# EasyEDA Pro project ProPrj_Xen_2025-02-04.epro, board PCB1_4
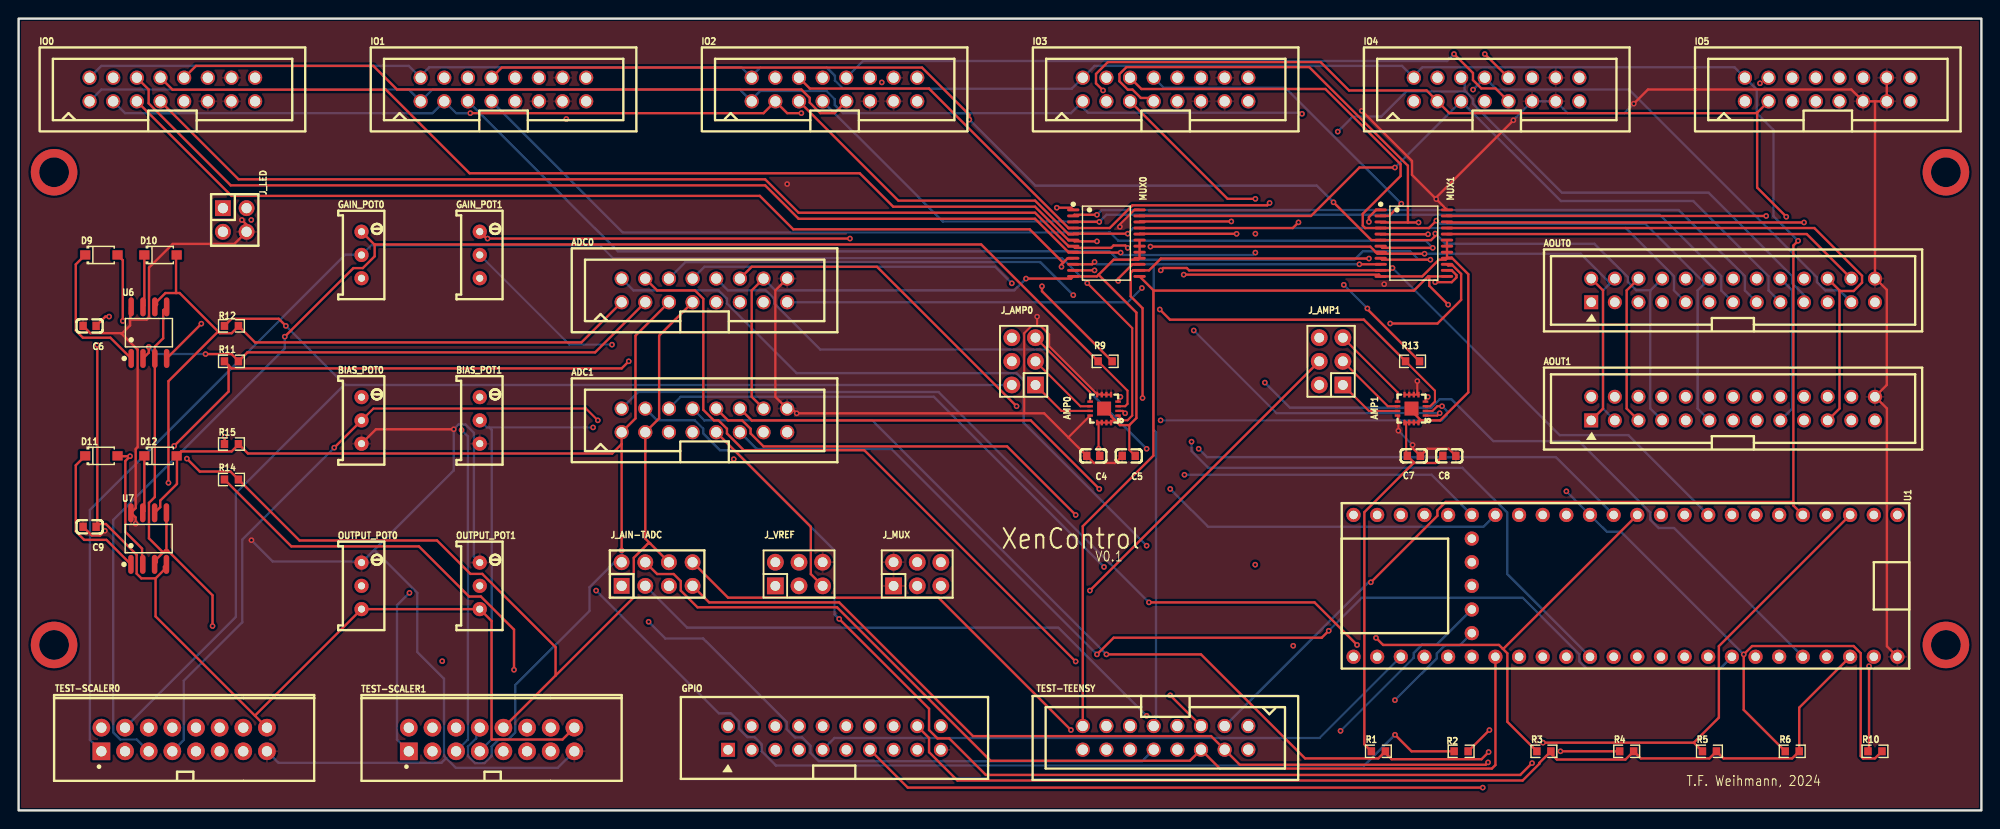
[diagram p32: board, top side]
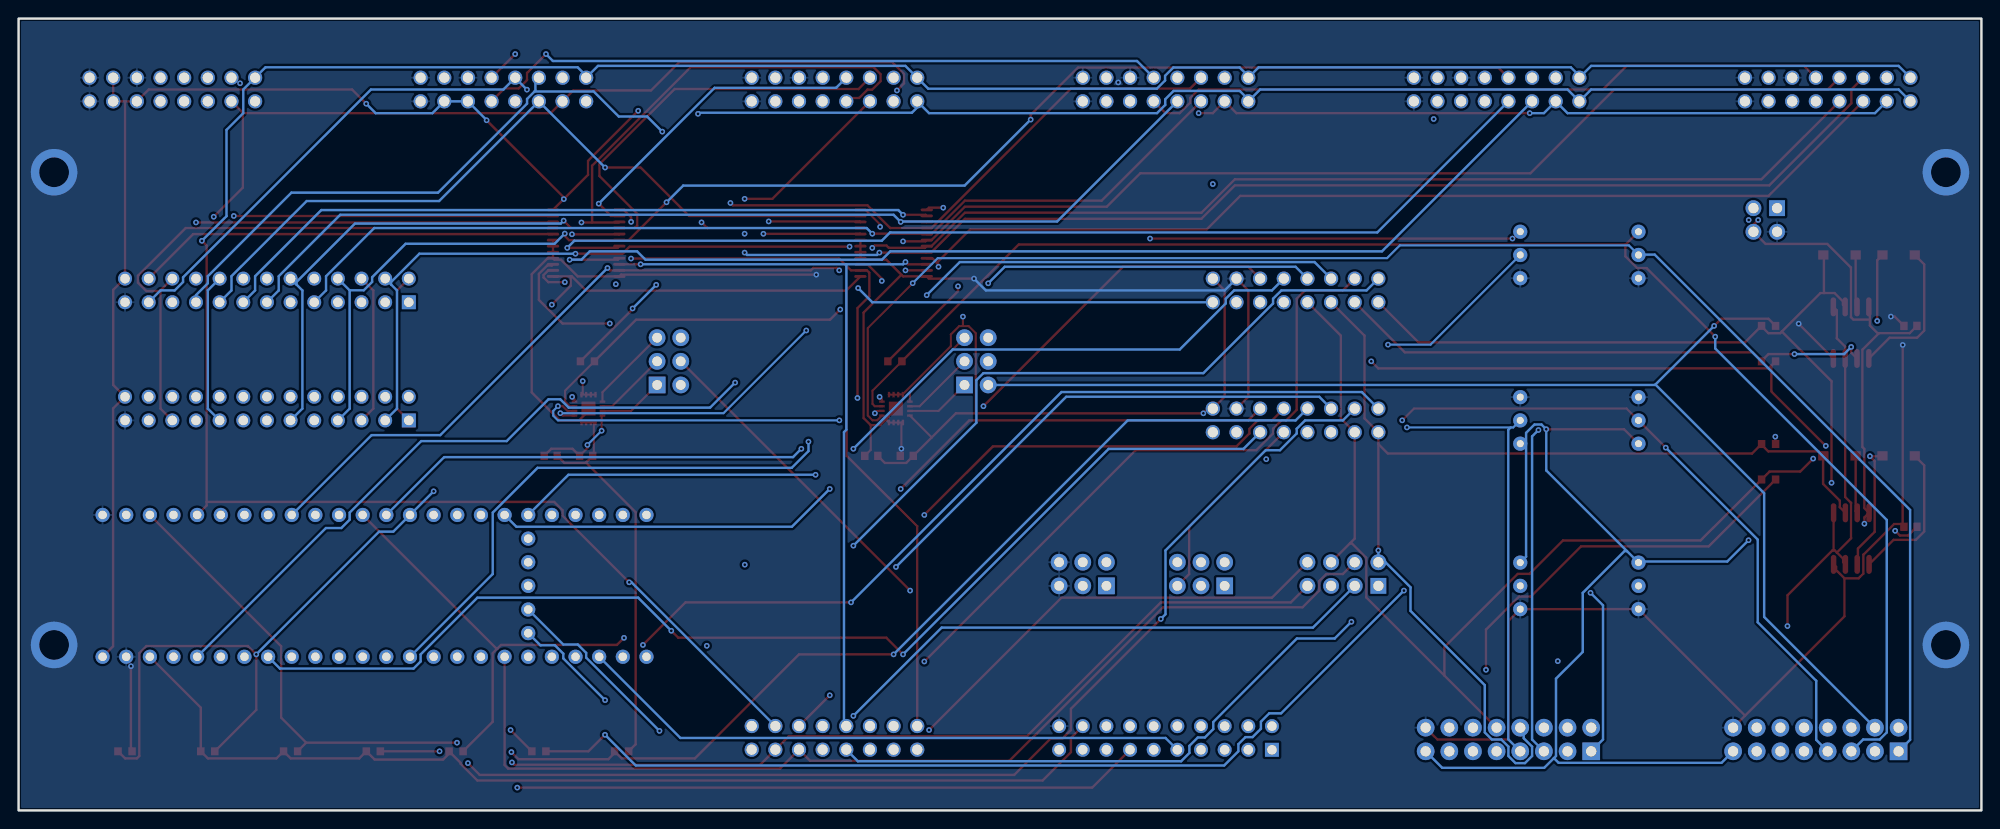
[diagram p33: board, bottom side, seen from below]

Outline 210.82 x 85.09 mm; copper layers: Top Layer, Inner1, Inner2, Bottom Layer. Coordinates in mm from the lower left corner of the outline.
Outline path: rectangle 0,85.09 210.82,0
Stack: Top Layer 0.035mm Outer layer copper thickness 1oz / Dielectric1 0.2104mm 7628 RC49% 8.6mil / Inner1 0.0152mm Inner layer copper thickness / Dielectric2 1.065mm 1.1mm H/HOZ Copper / Inner2 0.0152mm Inner layer copper thickness / Dielectric3 0.2104mm 7628 RC49% 8.6mil / Bottom Layer 0.035mm Outer layer copper thickness 1oz

## Design rules (mm)
template: Custom Config
spacing copperThickness1oz (default): track to track 0.102, other pairs 0.152 to 0.3
spacing copperThickness2oz: track to track 0.203, other pairs 0.152 to 0.3
track width Default (default): min 0.127, default 0.254, max 2.54
track width Analog: min 0.127, default 0.254, max 2.54
track width Power: min 0.127, default 0.254, max 2.54
differential pair differentialPair (default): width min 0.127, default 0.254, max 2.54; gap min 0.152, default 0.152
via viaSize (default): diameter min 0.5, default 0.61, max 10; hole min 0.3, default 0.305, max 6.299
net LIMITER_OUT0- uses Analog
net LIMITER_OUT0+ uses Analog
net LIMITER_OUT1- uses Analog
net LIMITER_OUT1+ uses Analog
net MUX_OUT0 uses Analog
net GND uses Power
net MUX_OUT1 uses Analog
net +5V uses Power
net AM23 uses Analog
net AM11 uses Analog
net AM22 uses Analog
net AM10 uses Analog
net AM21 uses Analog
net AM9 uses Analog
net AM20 uses Analog
net AM8 uses Analog
net AM19 uses Analog
net AM7 uses Analog
net AM18 uses Analog
net AM6 uses Analog
net AM17 uses Analog
net AM5 uses Analog
net AM16 uses Analog
net AM4 uses Analog
net AM15 uses Analog
net AM3 uses Analog
net AM14 uses Analog
net AM2 uses Analog
net AM13 uses Analog
net AM1 uses Analog
net AM12 uses Analog
net AM0 uses Analog
net OFFSET_OUT0+ uses Analog
net OFFSET_OUT0- uses Analog
net OFFSET_OUT1+ uses Analog
net OFFSET_OUT1- uses Analog

## Placement (name value [footprint] x y rotation side)
ADC0  2.54-2*8P简牛  [IDC-TH_16P-P2.54_C3406]  73.66 55.88 0 top
ADC1  2.54-2*8P简牛  [IDC-TH_16P-P2.54_C3406]  73.66 41.91 0 top
AMP0  THS4541IRGTT  [TQFN-16_L3.0-W3.0-P0.50-BL-EP1.5]  116.59 43.18 90 top
AMP1  THS4541IRGTT  [TQFN-16_L3.0-W3.0-P0.50-BL-EP1.5]  149.61 43.18 90 top
AOUT0  ZX-IDC2.54-2-13PZZ  [IDC-TH_26P-P2.54_ZX-IDC2.54-2-13PZZ]  184.15 55.88 0 top
AOUT1  ZX-IDC2.54-2-13PZZ  [IDC-TH_26P-P2.54_ZX-IDC2.54-2-13PZZ]  184.15 43.18 0 top
BIAS_POT0  50kΩ  [RES-ADJ-TH_3P-L9.5-W4.85-P2.50-BL-BS]  36.83 41.91 0 top
BIAS_POT1  50kΩ  [RES-ADJ-TH_3P-L9.5-W4.85-P2.50-BL-BS]  49.53 41.91 0 top
C4  0.1uF  [C0603]  115.42 38.1 180 top
C5  1000pF  [C0603]  119.23 38.1 180 top
C6  0.1uF  [C0603]  7.62 52.07 180 top
C7  0.1uF  [C0603]  149.86 38.1 0 top
C8  1000pF  [C0603]  153.67 38.1 0 top
C9  0.1uF  [C0603]  7.62 30.48 180 top
D9  1N4148W  [SOD-123F_L2.7-W1.6-LS3.8-RD]  8.89 59.69 0 top
D10  1N4148W  [SOD-123F_L2.7-W1.6-LS3.8-RD]  15.24 59.69 0 top
D11  1N4148W  [SOD-123F_L2.7-W1.6-LS3.8-RD]  8.89 38.1 0 top
D12  1N4148W  [SOD-123F_L2.7-W1.6-LS3.8-RD]  15.24 38.1 0 top
GAIN_POT0  200kΩ  [RES-ADJ-TH_3P-L9.5-W4.85-P2.50-BL-BS]  36.83 59.69 0 top
GAIN_POT1  200kΩ  [RES-ADJ-TH_3P-L9.5-W4.85-P2.50-BL-BS]  49.53 59.69 0 top
GPIO  ZX-IDC2.54-2-10PZZ  [IDC-TH_20P-P2.54_ZX-IDC2.54-2-10PZZ]  87.63 7.78 0 top
IO0  2.54-2*8P简牛  [IDC-TH_16P-P2.54_C3406]  16.51 77.47 0 top
IO1  2.54-2*8P简牛  [IDC-TH_16P-P2.54_C3406]  52.07 77.47 0 top
IO2  2.54-2*8P简牛  [IDC-TH_16P-P2.54_C3406]  87.63 77.47 0 top
IO3  2.54-2*8P简牛  [IDC-TH_16P-P2.54_C3406]  123.19 77.47 0 top
IO4  2.54-2*8P简牛  [IDC-TH_16P-P2.54_C3406]  158.75 77.47 0 top
IO5  2.54-2*8P简牛  [IDC-TH_16P-P2.54_C3406]  194.31 77.47 0 top
J_AIN-TADC  PZ2.54-2*4  [HDR-TH_8P-P2.54-V-M-R2-C4-S2.54]  68.58 25.4 0 top
J_AMP0  ZX-PZ2.54-2-3PZZ  [HDR-TH_6P-P2.54-V-M-R2-C3-S2.54-1]  107.95 48.26 90 top
J_AMP1  ZX-PZ2.54-2-3PZZ  [HDR-TH_6P-P2.54-V-M-R2-C3-S2.54-1]  140.97 48.26 90 top
J_LED  PZ254V-12-4P  [HDR-TH_4P-P2.54-V-M-R2-C2-S2.54]  23.21 63.45 270 top
J_MUX  ZX-PZ2.54-2-3PZZ  [HDR-TH_6P-P2.54-V-M-R2-C3-S2.54-1]  96.52 25.4 0 top
J_VREF  ZX-PZ2.54-2-3PZZ  [HDR-TH_6P-P2.54-V-M-R2-C3-S2.54-1]  83.82 25.4 0 top
MUX0  CD74HC4067SM96  [SSOP-24_L8.1-W5.3-P0.65-LS7.8-BL]  116.84 60.96 270 top
MUX1  CD74HC4067SM96  [SSOP-24_L8.1-W5.3-P0.65-LS7.8-BL]  149.86 60.96 270 top
OUTPUT_POT0  50kΩ  [RES-ADJ-TH_3P-L9.5-W4.85-P2.50-BL-BS]  36.83 24.13 0 top
OUTPUT_POT1  50kΩ  [RES-ADJ-TH_3P-L9.5-W4.85-P2.50-BL-BS]  49.53 24.13 0 top
R1  10K  [R0603]  146.05 6.35 0 top
R2  330  [R0603]  154.94 6.35 0 top
R3  10K  [R0603]  163.83 6.35 0 top
R4  10K  [R0603]  172.72 6.35 0 top
R5  10K  [R0603]  181.61 6.35 0 top
R6  10K  [R0603]  190.5 6.35 0 top
R9  12K  [R0603]  116.7 48.26 0 top
R10  10K  [R0603]  199.39 6.35 0 top
R11  1k  [R0603]  22.86 48.26 0 top
R12  1k  [R0603]  22.86 52.07 0 top
R13  12K  [R0603]  149.72 48.26 0 top
R14  1k  [R0603]  22.86 35.56 0 top
R15  1k  [R0603]  22.86 39.37 0 top
TEST-SCALER0  IDC16  [CONN-TH_16P-P2.54_TE_1761681-6]  17.78 7.62 0 top
TEST-SCALER1  IDC16  [CONN-TH_16P-P2.54_TE_1761681-6]  50.8 7.62 0 top
TEST-TEENSY  2.54-2*8P简牛  [IDC-TH_16P-P2.54_C3406]  123.19 7.8 180 top
U1  -  [TEENSY 4.1]  171.45 24.13 270 top
U6  TL072G  [SOIC-8_L4.9-W3.9-P1.27-LS6.0-BL]  13.99 51.34 0 top
U7  TL072G  [SOIC-8_L4.9-W3.9-P1.27-LS6.0-BL]  13.97 29.21 0 top

## Footprints (pads in the part's own frame, mm; a bottom-side part is the same pattern mirrored in y, then rotated)
C0603
  rect 0.8x0.9 smd: 1(-0.7,0) 2(0.7,0)
CONN-TH_16P-P2.54_TE_1761681-6
  rect 1.9x1.9 hole 1.1: 1(-8.89,-1.27)
  round 1.9 hole 1.1: 2(-8.89,1.27) 3(-6.35,-1.27) 4(-6.35,1.269) 5(-3.81,-1.27) 6(-3.81,1.269) 7(-1.27,-1.27) 8(-1.27,1.269) 9(1.27,-1.27) 10(1.27,1.269) 11(3.81,-1.27) 12(3.81,1.269) 13(6.35,-1.27) 14(6.35,1.269) 15(8.89,-1.27) 16(8.89,1.269)
HDR-TH_4P-P2.54-V-M-R2-C2-S2.54
  rect 1.7x1.7 hole 1.1: 1(-1.27,-1.27)
  round 1.7 hole 1.1: 2(-1.27,1.27) 3(1.27,-1.27) 4(1.27,1.27)
HDR-TH_6P-P2.54-V-M-R2-C3-S2.54-1
  rect 1.8x1.8 hole 1.05: 1(-2.54,-1.27)
  round 1.8 hole 1.05: 2(-2.54,1.27) 3(0,-1.27) 4(0,1.27) 5(2.54,-1.27) 6(2.54,1.27)
HDR-TH_8P-P2.54-V-M-R2-C4-S2.54
  rect 1.7x1.7 hole 1.1: 1(-3.81,-1.27)
  round 1.7 hole 1.1: 2(-3.81,1.27) 3(-1.27,-1.27) 4(-1.27,1.27) 5(1.27,-1.27) 6(1.27,1.27) 7(3.81,-1.27) 8(3.81,1.27)
IDC-TH_16P-P2.54_C3406
  round 1.524 hole 1.1: 1(-8.89,-1.27) 2(-8.89,1.27) 3(-6.35,-1.27) 4(-6.35,1.27) 5(-3.81,-1.27) 6(-3.81,1.27) 7(-1.27,-1.27) 8(-1.27,1.27) 9(1.27,-1.27) 10(1.27,1.27) 11(3.81,-1.27) 12(3.81,1.27) 13(6.35,-1.27) 14(6.35,1.27) 15(8.89,-1.27) 16(8.89,1.27)
IDC-TH_20P-P2.54_ZX-IDC2.54-2-10PZZ
  rect 1.5x1.5 hole 1.02: 1(-11.43,-1.27)
  round 1.5 hole 1.02: 2(-11.43,1.27) 3(-8.89,-1.27) 4(-8.89,1.27) 5(-6.35,-1.27) 6(-6.35,1.27) 7(-3.81,-1.27) 8(-3.81,1.27) 9(-1.27,-1.27) 10(-1.27,1.27) 11(1.27,-1.27) 12(1.27,1.27) 13(3.81,-1.27) 14(3.81,1.27) 15(6.35,-1.27) 16(6.35,1.27) 17(8.89,-1.27) 18(8.89,1.27) 19(11.43,-1.27) 20(11.43,1.27)
IDC-TH_26P-P2.54_ZX-IDC2.54-2-13PZZ
  rect 1.5x1.5 hole 1.02: 1(-15.24,-1.27)
  round 1.5 hole 1.02: 2(-15.24,1.27) 3(-12.7,-1.27) 4(-12.7,1.27) 5(-10.16,-1.27) 6(-10.16,1.27) 7(-7.62,-1.27) 8(-7.62,1.27) 9(-5.08,-1.27) 10(-5.08,1.27) 11(-2.54,-1.27) 12(-2.54,1.27) 13(0,-1.27) 14(0,1.27) 15(2.54,-1.27) 16(2.54,1.27) 17(5.08,-1.27) 18(5.08,1.27) 19(7.62,-1.27) 20(7.62,1.27) 21(10.16,-1.27) 22(10.16,1.27) 23(12.7,-1.27) 24(12.7,1.27) 25(15.24,-1.27) 26(15.24,1.27)
R0603
  rect 0.806x0.864 smd: 1(-0.753,0) 2(0.753,0)
RES-ADJ-TH_3P-L9.5-W4.85-P2.50-BL-BS
  round 1.524 hole 0.762: 1(0,2.5) 2(0,0) 3(0,-2.5)
SOD-123F_L2.7-W1.6-LS3.8-RD
  rect 1.1x1 smd: 1(-1.735,0) 2(1.735,0)
SOIC-8_L4.9-W3.9-P1.27-LS6.0-BL
  oval 0.588x2.045 smd: 1(-1.905,-2.772) 2(-0.635,-2.772) 3(0.635,-2.772) 4(1.905,-2.772) 5(1.905,2.772) 6(0.635,2.772) 7(-0.635,2.772) 8(-1.905,2.772)
SSOP-24_L8.1-W5.3-P0.65-LS7.8-BL
  oval 0.308x1.324 smd: 1(-3.575,-3.562) 2(-2.925,-3.562) 3(-2.275,-3.562) 4(-1.625,-3.562) 5(-0.975,-3.562) 6(-0.325,-3.562) 7(0.325,-3.562) 8(0.975,-3.562) 9(1.625,-3.562) 10(2.275,-3.562) 11(2.925,-3.562) 12(3.575,-3.562) 13(3.575,3.562) 14(2.925,3.562) 15(2.275,3.562) 16(1.625,3.562) 17(0.975,3.562) 18(0.325,3.562) 19(-0.325,3.562) 20(-0.975,3.562) 21(-1.625,3.562) 22(-2.275,3.562) 23(-2.925,3.562) 24(-3.575,3.562)
TEENSY 4.1
  round 1.524 hole 0.914: 1(-7.62,30.353) 2(-7.62,27.813) 3(-7.62,25.273) 4(-7.62,22.733) 5(-7.62,20.193) 6(-7.62,17.653) 7(-7.62,15.113) 8(-7.62,12.573) 9(-7.62,10.033) 10(-7.62,7.493) 11(-7.62,4.953) 12(-7.62,2.413) 13(-7.62,-0.127) 14(-7.62,-2.667) 15(-7.62,-5.207) 16(-7.62,-7.747) 17(-7.62,-10.287) 18(-7.62,-12.827) 19(-7.62,-15.367) 20(-7.62,-17.907) 21(-7.62,-20.447) 22(-7.62,-22.987) 23(-7.62,-25.527) 24(-7.62,-28.067) 25(7.62,30.353) 26(7.62,27.813) 27(7.62,25.273) 28(7.62,22.733) 29(7.62,20.193) 30(7.62,17.653) 31(7.62,15.113) 32(7.62,12.573) 33(7.62,10.033) 34(7.62,7.493) 35(7.62,4.953) 36(7.62,2.413) 37(7.62,-0.127) 38(7.62,-2.667) 39(7.62,-5.207) 40(7.62,-7.747) 41(7.62,-10.287) 42(7.62,-12.827) 43(7.62,-15.367) 44(7.62,-17.907) 45(7.62,-20.447) 46(7.62,-22.987) 47(7.62,-25.527) 48(7.62,-28.067) 49(5.08,-15.367) 50(2.54,-15.367) 51(0,-15.367) 52(-2.54,-15.367) 53(-5.08,-15.367)
TQFN-16_L3.0-W3.0-P0.50-BL-EP1.5
  rect 0.25x0.6 smd: 1(-0.749,-1.5) 2(-0.248,-1.5) 3(0.252,-1.5) 4(0.751,-1.5) 9(0.75,1.5) 10(0.25,1.5) 11(-0.25,1.5) 12(-0.749,1.5)
  rect 0.6x0.25 smd: 5(1.5,-0.748) 6(1.5,-0.248) 7(1.5,0.252) 8(1.5,0.752) 13(-1.5,0.752) 14(-1.5,0.252) 15(-1.5,-0.248) 16(-1.5,-0.748)
  rect 1.5x1.5 smd: 17(0,0)

## Nets
As in the schematic.

Pads without a net: IO5 10; TEST-SCALER0 9 11 13; TEST-SCALER1 9 11 13; TEST-TEENSY 12 14 16; U1 15 39 51 52 53

## Via types
v1: diameter 0.61, hole 0.305, Top Layer to Bottom Layer, 158 vias
v2: diameter 5, hole 3.2, Top Layer to Bottom Layer, 4 vias

## Routing (per net, layer and track width the routed paths; a pad name or vN(x,y) marks a point on that pad's centre or on a via; arc(x,y) is an arc through that point)
+3.3V: length 210.7
  Top Layer w0.254: U1.27 191.25,11.04 R6.2 190.49,5.59 183.13,5.59 R5.2 181.6,5.59 174.24,5.59 R4.2 172.59,5.47 165.22,5.47 164.46,6.23 ; GPIO.18 97.79,7.78 97.79,6.26 100.84,3.21 161.54,3.21 163.34,5.01 163.34,5.11 164.46,6.23 ; 164.46,6.23 R3.2
  Inner1 w0.254: 81.29,26.68 82.56,25.41 82.56,23.13 81.66,22.23 70.49,22.23 TEST-SCALER1.14 55.88,10.16 25.4,10.16 TEST-SCALER0.14 ; 81.29,26.68 82.46,27.85 84.33,27.85 85.09,27.09 85.09,20.48 GPIO.18 ; 81.29,26.68 J_VREF.2
+5V: length 672
  Top Layer w0.225: AMP1.12 148.2,42.34 v1(148.2,40.8) ; 109.39,52.05 108.78,52.05 108.01,51.28 108.01,42.67 ; 109.39,52.05 109.79,52.05 110.69,51.15 110.69,49.88 115.84,44.73 115.84,44.71 ; 109.39,52.05 v1(109.39,53.06) ; AMP0.5 AMP0.6 AMP0.7 116.31,44.71 115.84,44.71 ; C7.2 149.72,38.94 v1(149.72,39.28) ; MUX0.24 119.85,64.54 118.28,62.97 v1(118.28,62.71) ; 115.84,44.71 AMP0.8 ; 112.76,40.07 112.76,40.1 AMP0.12 ; v1(150.23,46.13) 150.23,44.81 AMP1.5 AMP1.6 AMP1.7 AMP1.8
  Top Layer w0.254: v1(23.98,63.45) 24.48,62.94 J_LED.4 23.18,60.88 16.55,60.88 14.01,58.34 14.01,53 13.75,52.75 11.98,52.75 ; ADC0.16 81.28,55.88 81.28,44.45 ADC1.16 83.06,43.18 v1(83.57,42.67) 110.15,42.67 112.76,40.07 C4.2 115.49,37.34 117.77,37.34 C5.2 ; 199.39,76.2 IO5.11 196.85,77.47 175.01,77.47 v1(173.48,75.95) ; 199.39,76.2 199.39,57.21 ; 199.39,76.2 IO5.13 IO5.14 ; BIAS_POT0.3 38.38,40.96 v1(46.74,40.96) ; 199.4,44.46 200.67,43.19 200.67,17.64 U1.25 ; 199.4,44.46 200.66,45.72 200.66,55.94 199.39,57.21 ; 199.4,44.46 AOUT1.26 ; MUX1.24 v1(152.26,65.69) 152.17,65.78 ; 12.09,54.11 11.98,54 11.98,52.75 ; 199.39,57.21 AOUT0.26 ; 152.17,65.78 149.66,68.3 149.66,69.8 v1(144.27,75.18) ; 152.17,65.78 v1(160.56,74.16) ; 11.08,51.21 12.78,49.51 12.78,39.05 12.57,38.84 12.57,32.49 U7.8 12.56,31.48 v1(12.56,30.81) ; 11.08,51.21 11.98,52.11 11.98,52.75 ; 11.08,51.21 11.01,51.29 7.7,51.29 C6.2 ; C8.2 153.61,38.86 151.32,38.86 C7.2 ; C9.2 7.86,29.54 8.75,29.54 v1(9.26,30.05)
  Inner1 w0.225: v1(150.23,46.13) 146.68,49.69 v1(146.68,56.55) ; v1(109.39,53.06) 109.39,53.82 v1(118.28,62.71)
  Inner1 w0.254: 48.26,40.7 48.26,50.8 64.77,67.31 ; 48.26,40.7 48.26,40.68 BIAS_POT1.3 ; 48.26,40.7 47.75,40.2 47.24,40.2 46.74,40.7 v1(46.74,40.96) ; 22.9,76.16 23.21,75.85 23.21,64.21 v1(23.98,63.45) ; 22.9,76.16 IO0.13 ; 22.9,76.16 22.58,76.16 ; v1(9.26,30.05) 10.02,30.81 v1(12.56,30.81) ; 58.17,75.95 58.17,73.91 64.77,67.31 ; 58.17,75.95 IO1.13 IO1.14 ; 58.17,75.95 56.13,75.95 IO1.11 ; v1(83.57,42.67) 84.46,41.77 84.46,28.57 J_VREF.6 J_MUX.2 J_MUX.1 97.57,20.54 97.57,8 GPIO.19 ; 22.58,76.16 22.58,78.46 IO0.14 ; 22.58,76.16 20.36,76.16 IO0.11 ; 64.77,67.31 v1(82.55,67.31)
  Inner2 w0.225: v1(150.23,46.13) 150.23,42.83 v1(148.2,40.8) ; v1(146.68,56.55) 149.32,59.19 149.32,63 152.01,65.69 v1(152.26,65.69)
  Inner2 w0.254: v1(25.01,29.03) 14.34,29.03 v1(12.56,30.81) ; IO3.13 130.81,74.93 133.35,74.93 134.11,75.69 143.76,75.69 v1(144.27,75.18) ; IO3.13 IO3.14 ; IO3.13 IO3.11 126.37,75.57 126.37,70.8 v1(118.28,62.71) ; IO2.14 IO2.13 IO2.11 v1(82.55,67.31) ADC0.16 ; IO4.14 IO4.11 160.56,74.2 v1(160.56,74.16)
  Bottom Layer w0.225: v1(148.2,40.8) v1(149.72,39.28)
  Bottom Layer w0.254: TEST-SCALER0.15 27.91,5.11 45.41,5.11 45.91,5.62 ; 45.91,5.62 45.69,5.84 45.69,14.15 42.81,17.03 42.81,23.38 38.32,27.87 38.07,27.87 ; 45.91,5.62 46.96,4.57 57.91,4.57 TEST-SCALER1.15 ; 38.07,27.87 36.95,26.75 ; 38.07,27.87 46.74,36.54 v1(46.74,40.96) 47.24,41.47 48.01,41.47 48.9,40.57 48.9,27.26 OUTPUT_POT1.1 ; 36.95,26.75 OUTPUT_POT0.1 ; 36.95,26.75 27.3,26.75 v1(25.01,29.03) ; v1(173.48,75.95) 172.47,74.93 166.37,74.93 IO4.13 IO4.11 160.56,74.2 v1(160.56,74.16)
GND: length 741.5
  Top Layer w0.225: 116,41.68 AMP0.14 AMP0.15 AMP0.16 117.64,41.99 117.7,41.99 ; 116,41.68 AMP0.13 ; 116,41.68 v1(116,38.87) 116,38.22 C4.1 ; C5.1 119.3,38.74 119.3,41.4 ; C7.1 149.04,38.22 149.04,41.7 ; 149.87,41.7 149.37,41.7 ; 149.87,41.7 150.37,41.7 ; 149.87,41.7 AMP1.15 ; 149.37,41.7 149.04,41.7 ; 149.37,41.7 AMP1.14 ; AMP1.13 148.87,41.7 149.04,41.7 ; 150.37,41.7 AMP1.16 ; 150.37,41.7 150.58,41.96
  Top Layer w0.254: 149.88,37.38 149.92,37.34 152.21,37.34 C8.1 ; 149.88,37.38 C7.1 ; 149.88,37.38 144.54,32.05 144.54,7.1 R1.1 ; 25.4,10.16 14.71,20.85 14.71,24.93 ; 25.4,10.16 TEST-SCALER0.16 ; 25.4,10.16 25.4,10.2 OUTPUT_POT0.3 OUTPUT_POT1.3 50.8,20.36 50.8,7.66 50.84,7.62 58.42,7.62 TEST-SCALER1.16 ; v1(19.63,52.31) 19.63,52.3 U6.4 ; 153.42,59.4 MUX1.17 MUX1.18 MUX1.19 ; 153.42,59.4 MUX1.16 153.27,59.18 152.56,59.18 150.76,57.39 MUX1.12 146.11,57.58 v1(125.14,57.58) ; 153.42,59.4 153.93,59.4 155.71,57.62 155.71,44.92 152.7,41.91 150.63,41.91 150.58,41.96 149.73,42.81 149.73,43.06 AMP1.17 ; v1(8.45,50.02) 8.45,30.61 ; 8.45,30.61 8.62,30.78 9.38,30.78 12.68,27.47 12.68,25.44 13.19,24.93 14.71,24.93 ; 8.45,30.61 C9.1 ; 116,57.56 117.61,59.18 120.25,59.18 MUX0.16 MUX0.17 MUX0.18 MUX0.19 ; 116,57.56 120.06,53.5 120.06,42.16 119.3,41.4 118.28,41.4 117.7,41.99 117.39,42.3 117.39,42.39 AMP0.17 ; 116,57.56 115.82,57.39 MUX0.12 113.04,57.15 v1(108.2,57.15) ; 14.71,24.93 15.61,25.83 15.61,26.17 U7.4 ; v1(9.72,53.07) 9.32,53.07 C6.1 ; ADC1.14 78.74,44.45 78.74,55.88 ADC0.14 ; v1(198.75,15.49) 198.75,6.47 R10.1
  Inner1 w0.254: 99.09,26.7 J_MUX.6 ; 99.09,26.7 99.09,24.16 J_MUX.5 GPIO.20 ; 99.09,26.7 111.26,38.87 v1(116,38.87) ; 95.25,77.47 IO2.16 ; 95.25,77.47 93.47,77.47 v1(92.71,78.23) ; 95.25,77.47 IO2.15 ; v1(19.63,52.31) 18.1,53.83 10.48,53.83 v1(9.72,53.07)
  Inner2 w0.254: 25.48,78.15 24.97,77.64 21.42,77.64 IO0.12 ; 25.48,78.15 25.48,78.66 IO0.16 ; 25.48,78.15 25.48,76.12 ; 25.72,58.4 26.94,57.19 GAIN_POT0.3 ; 25.72,58.4 v1(19.63,52.31) ; 25.72,58.4 23.97,60.15 ; 199.4,41.92 AOUT1.25 ; 199.4,41.92 199.4,34.15 U1.1 201.8,19.05 U1.26 199.26,16 v1(198.75,15.49) ; 199.4,41.92 200.66,43.18 200.66,53.34 AOUT0.25 203.2,58.42 IO5.15 IO5.16 202.1,79.84 199.05,79.84 198.04,78.82 ; 25.48,76.12 IO0.15 ; 25.48,76.12 25.75,75.85 25.75,61.68 24.23,60.15 23.97,60.15 ; 167.64,78.68 IO4.16 166.54,79.84 163.49,79.84 162.48,78.82 ; 167.64,78.68 168.91,79.95 196.91,79.95 198.04,78.82 ; 167.64,78.68 IO4.15 ; 162.48,78.82 161.35,79.95 133.35,79.95 132.08,78.68 ; 162.48,78.82 IO4.12 ; ADC0.14 80.01,65.79 ; 80.01,65.79 71.37,65.79 64.73,72.43 ; 80.01,65.79 90.17,75.95 90.17,77.47 IO2.12 92.2,78.74 v1(92.71,78.23) ; 132.08,78.68 IO3.15 ; 132.08,78.68 IO3.16 130.81,80.01 128.27,80.01 IO3.12 125.73,77.47 125.73,71.88 116,62.15 115.23,62.15 ; v1(8.45,50.02) 9.72,51.29 v1(9.72,53.07) ; 64.73,72.43 64.73,72.39 GAIN_POT1.3 ; 64.73,72.43 IO1.15 60.96,77.79 ; GAIN_POT1.3 BIAS_POT1.1 ; GAIN_POT1.3 GAIN_POT0.3 ; v1(125.14,57.58) 123.63,59.08 117.03,59.08 115.23,60.88 115.23,62.15 ; GAIN_POT0.3 BIAS_POT0.1 ; 23.97,60.15 J_LED.3 ; 60.96,77.79 60.71,77.53 57.09,77.53 IO1.12 ; 60.96,77.79 IO1.16 ; 198.04,78.82 IO5.12 ; v1(108.2,57.15) 109.73,55.63 110.24,55.63 111.13,56.52 111.13,58.56 114.73,62.15 115.23,62.15
  Bottom Layer w0.254: ADC0.14 81.28,55.88 106.93,55.88 v1(108.2,57.15)
  vias: v2(3.81,68.58) v2(3.81,17.78) v2(207.01,68.58) v2(207.01,17.78)
#CS0: length 150.9
  Top Layer w0.254: R3.1 159.9,9.52 159.9,16.88 159.41,17.38 ; U1.12 159.49,17.38 159.41,17.38 ; v1(145.8,18.54) 146.56,17.78 159,17.78 159.41,17.38 ; v1(113.54,16) 90.83,38.71 77.88,38.71 76.08,40.5 76.08,41.01 75.18,41.91 74.68,41.91 73.54,43.04 73.54,54.98 72.64,55.88 68.58,55.88 ADC0.4
  Inner2 w0.254: v1(113.54,16) 133.86,16 136.4,18.54 v1(145.8,18.54)
#CS1: length 174.2
  Top Layer w0.254: v1(165.61,6.35) R4.1 ; v1(88.14,20.57) 97.79,10.92 97.79,8.64 98.69,7.74 99.96,7.74 103.89,3.81 161.29,3.81 v1(162.56,5.08)
  Inner1 w0.254: v1(162.56,5.08) 164.34,5.08 v1(165.61,6.35) 177.93,6.35 187.81,16.23 187.81,20.29 U1.2
  Bottom Layer w0.254: ADC1.4 68.58,41.91 72.64,41.91 73.54,41.01 73.54,40.5 75.34,38.71 76.86,38.71 87.64,27.93 87.64,21.07 v1(88.14,20.57)
AM0: length 177.1
  Top Layer w0.254: MUX0.9 112.68,59.34 112.19,58.85 ; 112.19,58.85 108.6,62.45 83.2,62.45 79.61,66.04 22.86,66.04 IO0.5 ; 112.19,58.85 112.01,58.67 v1(112.01,58.42)
  Inner2 w0.254: v1(112.01,58.42) 115.06,55.37 168.15,55.37 AOUT0.1 AOUT1.2
AM1: length 181
  Top Layer w0.254: v1(118.36,59.94) 113.32,59.94 MUX0.8 112.77,59.99 109.18,63.58 83.78,63.58 80.19,67.17 22.78,67.17 13.96,75.99 13.96,77.48 IO0.6
  Inner1 w0.254: v1(132.84,59.94) 149.82,59.94 156.43,53.34 170.18,53.34 AOUT0.3
  Inner2 w0.254: AOUT0.3 AOUT1.4
  Bottom Layer w0.254: v1(132.84,59.94) 132.59,59.69 118.62,59.69 v1(118.36,59.94)
AM2: length 179.7
  Top Layer w0.254: IO0.7 23.62,67.82 80.19,67.82 83.78,64.23 109.18,64.23 112.77,60.64 MUX0.7 113.46,60.45 117.35,60.45 117.6,60.71 118.87,60.71 v1(119.13,60.45)
  Inner1 w0.254: AOUT0.5 172.72,55.88 167.64,55.88 162.31,61.21 133.6,61.21 v1(132.84,61.98)
  Inner2 w0.254: AOUT0.5 AOUT1.6 ; v1(132.84,61.98) 130.81,59.94 119.63,59.94 v1(119.13,60.45)
AM3: length 187.8
  Top Layer w0.254: v1(115.82,61.15) 113.41,61.15 MUX0.6 112.77,61.29 109.18,64.88 93.94,64.88 90.35,68.47 48.44,68.47 39.46,77.45 16.53,77.45 IO0.8
  Inner2 w0.254: v1(115.82,61.15) 115.92,61.25 131.16,61.25 133.86,63.94 145.29,63.94 145.8,63.44 145.8,56.58 146.56,55.82 175.26,55.82 176.53,54.55 ; 176.53,54.55 AOUT1.8 ; 176.53,54.55 AOUT0.7
AM4: length 115.8
  Top Layer w0.254: IO2.5 94.49,65.53 109.18,65.53 112.77,61.94 MUX0.5 113.32,61.98 v1(119.13,61.98)
  Inner2 w0.254: AOUT0.9 AOUT1.10
  Bottom Layer w0.254: v1(119.13,61.98) 119.74,62.59 172.62,62.59 177.8,57.4 177.8,55.88 AOUT0.9
AM5: length 121.8
  Top Layer w0.254: IO2.6 84.99,77.57 97.78,77.57 112.77,62.59 MUX0.4 117.19,62.59 119.63,65.02 134.11,65.02 v1(134.37,65.28)
  Inner1 w0.254: AOUT0.11 180.34,53.34 176.28,53.34 175.38,54.24 175.38,54.75 174.48,55.64 173.97,55.64 172.72,56.9 172.72,57.4 167.54,62.58 137.06,62.58 v1(134.37,65.28)
  Inner2 w0.254: AOUT0.11 AOUT1.12
AM6: length 121.2
  Top Layer w0.254: v1(116.08,63.25) 113.29,63.25 MUX0.3
  Inner2 w0.254: AOUT0.13 AOUT1.14
  Bottom Layer w0.254: AOUT0.13 182.88,55.88 182.88,57.4 176.28,64.01 116.84,64.01 116.12,63.29 ; 116.12,63.29 v1(116.08,63.25) ; 116.12,63.29 99.27,63.29 IO2.7
AM7: length 125.4
  Top Layer w0.254: MUX0.2 113.4,64.01 v1(115.82,64.01)
  Inner2 w0.254: v1(115.82,64.01) 99.82,80.01 87.63,80.01 IO2.8 ; AOUT0.15 AOUT1.16
  Bottom Layer w0.254: v1(115.82,64.01) 116.33,64.52 178.31,64.52 185.42,57.4 185.42,55.88 AOUT0.15
AM8: length 93.9
  Top Layer w0.254: v1(147.83,69.09) 144.02,69.09 138.81,63.89 MUX0.23
  Inner2 w0.254: AOUT0.17 AOUT1.18
  Bottom Layer w0.254: AOUT0.17 187.96,55.88 187.96,57.4 179.88,65.49 165.65,65.49 IO4.5 v1(147.83,69.09)
AM9: length 99.6
  Top Layer w0.254: MUX0.22 120.46,63.29 v1(130.26,63.29)
  Inner2 w0.254: v1(130.26,63.29) 131.83,64.86 133.1,64.86 141.18,72.94 v1(141.69,72.94) ; AOUT0.19 AOUT1.20
  Bottom Layer w0.254: v1(141.69,72.94) 143.31,74.57 146.36,74.57 149.05,77.26 155.4,77.26 ; IO4.6 155.31,78.37 155.31,77.35 155.4,77.26 ; AOUT0.19 191.77,55.37 190.5,56.64 190.5,57.4 181.52,66.38 165.77,66.38 156.21,75.95 156.21,76.45 155.4,77.26
AM10: length 99
  Top Layer w0.254: MUX0.21 136.86,62.59 v1(137.47,63.19)
  Inner1 w0.254: 157.54,76.14 155.74,74.35 148.63,74.35 v1(137.47,63.19) ; 157.54,76.14 175.5,58.18 177.02,58.18 177.92,57.29 177.92,56.78 178.82,55.88 193.04,55.88 AOUT0.21 ; 157.54,76.14 IO4.7
  Inner2 w0.254: AOUT0.21 AOUT1.22
AM11: length 103.9
  Top Layer w0.254: v1(130.82,61.96) 120.43,61.96 MUX0.20
  Inner2 w0.254: v1(130.82,61.96) 133.36,64.5 135.65,64.5 148.6,77.46 v1(156.22,77.46) ; AOUT0.23 AOUT1.24
  Bottom Layer w0.254: 157.49,78.73 IO4.8 ; 157.49,78.73 158.75,77.47 172.97,77.47 193.16,57.29 193.16,56.78 194.06,55.88 195.58,55.88 AOUT0.23 ; 157.49,78.73 v1(156.22,77.46)
AM12: length 151
  Top Layer w0.254: MUX1.9 146.45,59.18 v1(151.64,59.18) ; AOUT1.1 170.18,43.18 170.18,55.88 AOUT0.2
  Inner2 w0.254: v1(151.64,59.18) 153.67,57.15 AOUT0.2
  Bottom Layer w0.254: IO1.5 64.38,60.08 117.19,60.08 118.09,59.18 143.49,59.18 144.39,60.08 149.47,60.08 150.37,59.18 v1(151.64,59.18)
AM13: length 148.7
  Top Layer w0.254: 146.46,59.82 MUX1.8 ; 146.46,59.82 v1(151.01,59.82) ; 146.46,59.82 145.95,59.82 145.19,60.59 v1(121.57,60.59)
  Inner1 w0.254: v1(121.57,60.59) 113.49,68.67 64.46,68.67 v1(58.83,74.3)
  Inner2 w0.254: IO1.6 49.51,77.49 51.07,77.49 51.97,76.59 51.97,76.08 53.75,74.3 v1(58.83,74.3)
  Bottom Layer w0.254: AOUT1.3 170.18,43.18 170.18,55.88 170.82,56.52 ; 170.82,56.52 AOUT0.4 ; 170.82,56.52 170.82,56.78 167.77,59.82 v1(151.01,59.82)
AM14: length 153
  Top Layer w0.254: AOUT0.6 172.72,55.88 172.72,43.18 AOUT1.5 ; MUX1.7 146.48,60.45 v1(151.89,60.45)
  Inner2 w0.254: v1(151.89,60.45) 153.92,58.42 172.72,58.42 AOUT0.6
  Bottom Layer w0.254: v1(151.89,60.45) 151.13,61.21 118.11,61.21 117.21,62.11 64.89,62.11 IO1.7
AM15: length 152.5
  Top Layer w0.254: v1(152.16,61.99) 152.16,61.74 151.71,61.29 MUX1.6 145.3,61.29 v1(141.23,65.35) ; v1(102.12,74.24) 102.12,74.75 97.04,79.83 51.89,79.83 IO1.8
  Bottom Layer w0.254: 175.27,55.89 173.75,55.89 172.85,56.79 172.85,57.3 169.26,60.89 153.26,60.89 v1(152.16,61.99) ; 175.27,55.89 AOUT0.8 ; 175.27,55.89 175.26,55.88 175.26,43.18 AOUT1.7 ; v1(141.23,65.35) 139.44,67.15 109.21,67.15 v1(102.12,74.24)
AM16: length 88.5
  Top Layer w0.254: v1(151.38,61.91) 146.32,61.91 MUX1.5 ; v1(132.84,65.72) 129.86,65.72 IO3.5
  Inner1 w0.254: v1(151.38,61.91) 136.65,61.91 v1(132.84,65.72)
  Inner2 w0.254: 177.8,55.82 177.8,43.18 AOUT1.9 ; 177.8,55.82 177.8,55.88 AOUT0.10 ; 177.8,55.82 176.28,55.82 175.38,56.71 175.38,57.22 173.58,59.02 154.28,59.02 v1(151.38,61.91)
AM17: length 97.5
  Top Layer w0.254: IO3.6 120.59,77.53 140.35,77.53 148.44,69.44 148.44,68.17 144.37,64.11 144.37,62.84 144.63,62.59 MUX1.4 151.49,62.59 v1(152.28,63.38)
  Bottom Layer w0.254: 180.98,56.52 180.34,55.88 180.34,43.18 AOUT1.11 ; 180.98,56.52 180.98,56.78 174.69,63.06 152.6,63.06 v1(152.28,63.38) ; 180.98,56.52 AOUT0.12
AM18: length 103.4
  Top Layer w0.254: 149.22,63.18 146.35,63.18 MUX1.3 ; 149.22,63.18 149.22,69.28 138.62,79.88 119,79.88 118.24,79.12 118.24,78.36 119.13,77.46 119.64,77.46 120.54,76.56 121.56,76.56 IO3.7 ; 149.22,63.18 v1(150.37,63.18)
  Inner2 w0.254: 182.88,55.82 182.88,43.18 AOUT1.13 ; 182.88,55.82 182.88,55.88 AOUT0.14 ; 182.88,55.82 181.36,55.82 180.46,56.71 180.46,57.22 175.07,62.61 150.94,62.61 v1(150.37,63.18)
AM19: length 93.6
  Top Layer w0.254: MUX1.2 147.2,63.89 v1(148.51,65.2)
  Inner2 w0.254: AOUT0.16 186.11,56.57 ; 186.11,56.57 186.11,56.82 176.45,66.47 149.78,66.47 v1(148.51,65.2) ; 186.11,56.57 185.42,55.88 185.42,43.18 AOUT1.15
  Bottom Layer w0.254: v1(148.51,65.2) 136.07,77.65 123.01,77.65 IO3.8
AM20: length 71.7
  Top Layer w0.254: v1(187.71,63.88) 153.43,63.88
  Inner2 w0.254: AOUT0.18 189.23,63.88 ; 189.23,63.88 v1(187.71,63.88) ; 189.23,63.88 189.23,74.93 IO5.5
  Bottom Layer w0.254: AOUT1.17 190.5,43.18 190.5,55.88 AOUT0.18
AM21: length 76.8
  Top Layer w0.254: v1(191.77,63.18) 153.47,63.18 MUX1.22
  Inner2 w0.254: IO5.6 191.77,77.47 v1(191.77,63.18) AOUT0.20 193.04,55.88 193.04,43.18 AOUT1.19
AM22: length 86.1
  Top Layer w0.254: 195.58,55.82 195.58,55.88 AOUT0.22 ; 195.58,55.82 195.58,43.18 AOUT1.21 ; 195.58,55.82 197.1,55.82 198,56.71 198,57.46 192.88,62.59 MUX1.21
  Inner2 w0.254: IO5.7 194.31,74.93 AOUT0.22
AM23: length 84.9
  Top Layer w0.254: AOUT0.24 192.06,61.94 MUX1.20
  Inner1 w0.254: AOUT0.24 198.12,55.88 198.12,43.18 AOUT1.23
  Inner2 w0.254: IO5.8 194.31,77.47 194.31,75.69 196.85,73.15 AOUT0.24
DRDY0: length 138.5
  Inner2 w0.254: U1.30 174.98,30.64 174.98,32.16 153.43,53.71 146.69,53.71 145.8,54.61 114.05,54.61 v1(113.28,55.37)
  Bottom Layer w0.254: v1(113.28,55.37) 109.73,58.93 71.63,58.93 ADC0.6
DRDY1: length 129.9
  Inner2 w0.254: v1(116.59,26.16) 120.4,26.16 127.25,33.02 164.08,33.02 164.98,32.12 164.98,31.36 165.88,30.46 167.53,30.46 U1.33
  Bottom Layer w0.254: v1(116.59,26.16) 98.3,44.45 71.12,44.45 ADC1.6
FB0+: length 123.5
  Top Layer w0.225: v1(118.34,44.44) 118.09,44.19 AMP0.4
  Inner2 w0.225: v1(118.34,44.44) 63.73,44.44 61.04,41.75 61.04,41.49 27.16,7.61 12.69,7.61 TEST-SCALER0.3
FB0-: length 165.3
  Top Layer w0.225: AMP0.1 118.6,41.92 119.11,41.92 119.61,42.43 119.61,51.83 v1(114.79,56.66)
  Bottom Layer w0.225: GAIN_POT0.2 36.87,59.73 37.86,60.72 62.46,60.72 63.83,59.35 112.09,59.35 v1(114.79,56.66)
  Bottom Layer w0.254: 36.87,59.73 35.09,59.73 7.66,32.29 7.66,7.58 TEST-SCALER0.1
FB1+: length 123.3
  Top Layer w0.225: AMP1.4 151.11,44.19 v1(151.36,44.44)
  Inner1 w0.225: v1(151.36,44.44) 150.86,44.44 v1(132.82,26.41)
  Inner2 w0.225: TEST-SCALER1.3 45.71,7.61 72.12,7.61 85.83,21.33 127.74,21.33 v1(132.82,26.41)
FB1-: length 167
  Top Layer w0.225: AMP1.1 152.38,42.43 v1(152.63,42.69)
  Inner2 w0.225: v1(63.73,50.05) 64.24,49.54 124.19,49.54 v1(126.22,51.58)
  Inner2 w0.254: v1(41.98,23.38) 64.33,45.73 64.33,49.54
  Bottom Layer w0.225: v1(152.63,42.69) 135.11,42.69 v1(126.22,51.58) ; v1(63.73,50.05) 59.17,50.05 GAIN_POT1.2
  Bottom Layer w0.254: TEST-SCALER1.1 40.64,7.62 40.64,22.04 v1(41.98,23.38)
IN0+: length 128.2
  Top Layer w0.225: AMP0.2 118.6,42.93 v1(118.85,42.68) ; 36.95,42.03 38.11,43.19 60.94,43.19 v1(62.21,41.92)
  Top Layer w0.254: 36.95,42.03 BIAS_POT0.2 v1(33.9,38.98)
  Inner2 w0.225: v1(118.85,42.68) 118.09,41.92 v1(62.21,41.92)
  Bottom Layer w0.254: v1(33.9,38.98) 24.03,29.11 24.03,20.22 17.74,13.93 17.74,7.58 TEST-SCALER0.7
IN0-: length 161.2
  Top Layer w0.225: AMP0.3 118.85,43.43 119.11,43.69 119.11,45.1 115.96,48.24
  Top Layer w0.254: 38.24,60.82 103.39,60.82 R9.1 115.96,48.24 ; 38.24,60.82 38.2,60.82 GAIN_POT0.1 ; 38.24,60.82 38.24,59.55 36.97,58.28 35.95,58.28 v1(28.59,50.91)
  Bottom Layer w0.254: v1(28.59,50.91) 28.59,49.64 10.16,31.21 10.16,8.38 10.92,7.62 12.7,7.62 TEST-SCALER0.5
IN1+: length 144.8
  Top Layer w0.225: AMP1.2 151.87,42.93 152.38,43.44 v1(152.89,43.44)
  Inner2 w0.225: v1(61.7,41.15) 63.4,39.45 120.2,39.45 v1(122.66,41.92)
  Bottom Layer w0.225: v1(122.66,41.92) 152.89,41.92 153.4,42.42 153.4,42.93 v1(152.89,43.44) ; BIAS_POT1.2 50.29,41.15 v1(61.7,41.15)
  Bottom Layer w0.254: TEST-SCALER1.7 50.82,7.64 50.82,40.9 50.56,41.15
IN1-: length 169.3
  Top Layer w0.225: 148.98,48.24 152.13,45.1 152.13,43.94 151.62,43.43 AMP1.3
  Top Layer w0.254: v1(122.57,53.83) 123.67,52.74 144.49,52.74 R13.1 148.98,48.24 ; GAIN_POT1.1 50.27,61.45 v1(89.29,61.45)
  Inner1 w0.254: v1(50.37,61.45) 50.62,61.2 50.62,56.12 47.57,53.07 v1(47.57,40.88)
  Inner2 w0.254: v1(122.57,53.83) 110.63,53.83 107.04,57.43 93.32,57.43 v1(89.29,61.45)
  Bottom Layer w0.254: TEST-SCALER1.5 48.26,7.62 48.26,40.19 v1(47.57,40.88)
IO0: length 76.6
  Inner2 w0.254: GPIO.2 86.98,19.83 131.46,19.83 U1.24
IO1: length 76.6
  Inner2 w0.254: GPIO.4 88.62,18.93 133.1,18.93 U1.23
IO2: length 76.6
  Inner2 w0.254: U1.22 134.75,18.03 90.26,18.03 GPIO.6
IO3: length 76.6
  Inner1 w0.254: U1.21 136.94,17.69 v1(136.91,17.69)
  Inner2 w0.254: v1(136.91,17.69) 134.56,15.34 90.11,15.34 GPIO.8
IO4: length 81
  Inner2 w0.254: GPIO.10 90.85,13.54 142.96,13.54 U1.47 146.82,17.41 146.82,25.03 U1.20
IO5: length 82.8
  Inner2 w0.254: U1.17 157.36,27.95 157.36,26.46 156.46,25.56 155.96,25.56 147.14,16.75 147.14,16.24 142.65,11.75 91.59,11.75 GPIO.12
IO6: length 69
  Inner2 w0.254: GPIO.14 93.24,10.85 144.29,10.85 149.68,16.24 149.68,16.75 150.58,17.64 154.95,17.64 U1.43
IO7: length 71.6
  Inner2 w0.254: U1.48 141.45,14.58 90.36,14.58 84.97,9.19 84.97,8.68 84.07,7.78 77.47,7.78 GPIO.1
IO8: length 102.2
  Inner2 w0.254: U1.16 157.47,25.52 157.47,16.41 145.8,4.74 80.52,4.74 GPIO.3
IO9: length 77.5
  Inner2 w0.254: GPIO.5 82.55,5.24 142.28,5.24 U1.44
IO10: length 71.3
  Inner2 w0.254: GPIO.7 85.09,7.78 142.28,7.78 U1.45
IO11: length 66.2
  Bottom Layer w0.254: GPIO.9 87.63,7.78 139.74,7.78 U1.46
IO12: length 91.3
  Inner1 w0.254: GPIO.11 91.59,3.82 141.12,3.82 147.41,10.11 167.46,10.11 U1.36
IO13: length 87.4
  Top Layer w0.254: GPIO.13 95.5,2.45 v1(157.26,2.45)
  Inner2 w0.254: v1(157.26,2.45) U1.37
LDOUT1: length 74.6
  Top Layer w0.254: IO0.10 19.05,80.01 38.1,80.01 40.64,77.47 84.07,77.47 84.97,76.57 84.97,76.06 86.11,74.93 87.63,74.93 IO2.9
LDOUT2: length 74.7
  Top Layer w0.254: v1(154.18,81.28) 156.21,79.25 156.21,78.49 157.11,77.59 158.63,77.59 IO4.9
  Bottom Layer w0.254: IO2.10 90.7,80.54 153.43,80.54 v1(154.18,81.28)
LDOUT3: length 113.7
  Top Layer w0.254: v1(157.48,81.28) IO4.10
  Inner2 w0.254: IO1.9 52.07,77.47 52.07,78.99 54.1,81.03 101.09,81.03 101.6,80.52 156.72,80.52 v1(157.48,81.28)
LDOUT4: length 74.5
  Inner2 w0.254: IO3.9 123.39,75.13 105.46,75.13 100.08,80.52 55.12,80.52 IO1.10
LDOUT5: length 74.6
  Inner1 w0.254: IO3.10 125.73,77.47 155.19,77.47 156.09,78.37 156.09,78.88 157.23,80.01 168.66,80.01 171.2,77.47 194.31,77.47 IO5.9
LEDS: length 139.2
  Inner1 w0.254: v1(67.66,20.27) 65.78,22.16 64.51,22.16 25.89,60.77 25.89,62.55 v1(24.99,63.45)
  Inner2 w0.254: IO0.9 17.78,71.43 J_LED.2 24.48,63.96 v1(24.99,63.45)
  Bottom Layer w0.254: TEST-TEENSY.10 120.68,5.28 85.95,5.28 85.06,6.17 85.06,6.94 84.17,7.83 83.4,7.83 82.51,8.73 82.51,9.49 73.52,18.47 69.46,18.47 v1(67.66,20.27)
LIMITER_OUT0+: length 144.6
  Top Layer w0.254: 23.63,48.28 22.87,49.04 v1(20.08,49.04) ; 23.63,48.28 24.58,49.22 61.92,49.22 ADC0.3 ; 23.63,48.28 R11.2 ; v1(13.98,49.8) 13.98,49.19 U6.2 ; v1(11.19,52.6) 11.19,59.13 D9.2
  Inner1 w0.254: ADC0.3 70.9,51.02 70.9,42.13 ADC1.7 68.58,36.83 68.58,25.4 J_AIN-TADC.5 ; v1(13.98,49.8) v1(11.19,52.6) ; TEST-SCALER0.10 20.08,9.92 v1(20.08,49.04)
  Bottom Layer w0.254: v1(20.08,49.04) 14.74,49.04 v1(13.98,49.8)
LIMITER_OUT0-: length 139.4
  Top Layer w0.254: 21.43,51.46 21.61,51.28 22.88,51.28 23.64,52.04 ; 21.43,51.46 16.09,46.13 v1(16.09,35.21) ; 21.43,51.46 17.29,55.6 16.91,55.6 ; 14.63,54.11 14.87,54.35 14.87,54.7 15.77,55.6 16.91,55.6 ; 23.64,52.04 R12.2 ; 23.64,52.04 25.39,50.29 60.45,50.29 ADC0.1 ; 16.91,55.6 16.91,59.62 D10.2
  Inner1 w0.254: ADC0.1 68.36,51.02 68.36,42.13 ADC1.5 66.04,36.83 66.04,25.4 J_AIN-TADC.1 ; TEST-SCALER0.8 16.09,9.3 v1(16.09,35.21)
LIMITER_OUT1+: length 128.8
  Top Layer w0.254: 67.85,28.67 67.59,28.67 66.07,27.15 66.07,22.89 57.67,14.49 ; 67.85,28.67 J_AIN-TADC.6 ; 67.85,28.67 67.31,29.21 ADC1.3 68.8,42.13 68.8,51.02 ADC0.7 ; D11.2 10.67,38.06 v1(11.97,38.06) 11.46,37.55 11.46,29.93 13.26,28.13 13.26,26.51 U7.2 ; v1(18.07,37.8) 19.46,36.42 22.76,36.42 R14.2 30.17,29.01 44.94,29.01 48.53,25.42 49.8,25.42 57.67,17.54 57.67,14.49 ; 57.67,14.49 TEST-SCALER1.10
  Inner2 w0.254: v1(11.97,38.06) 12.23,37.8 v1(18.07,37.8)
LIMITER_OUT1-: length 120.8
  Top Layer w0.254: 17.01,38.13 D12.2 ; 17.01,38.13 17.01,35.08 15.21,33.29 15.21,32.59 U7.6 ; 17.01,38.13 17.46,38.58 22.88,38.58 23.64,39.34 ; ADC0.5 66.26,51.02 66.26,42.13 ADC1.1 64.77,39.37 ; 64.77,39.37 v1(64.77,27.94) ; 64.77,39.37 63.75,38.35 24.63,38.35 23.64,39.34 ; 23.64,39.34 R15.2
  Bottom Layer w0.254: TEST-SCALER1.8 49.16,8.52 49.16,7.76 48.26,6.86 48.26,5.84 49.02,5.08 50.04,5.08 50.8,5.84 50.8,6.86 51.56,7.62 52.58,7.62 53.34,8.38 53.34,13.46 61.31,21.44 61.31,23.98 64.01,26.67 J_AIN-TADC.2 v1(64.77,27.94)
MISO0: length 170
  Top Layer w0.254: R10.2 199.38,5.59 198.11,5.59 197.86,5.84 197.86,16.9 197.09,17.66 186.19,17.66 v1(185.29,16.76) 185.29,10.8 R6.1
  Inner2 w0.254: v1(106.68,56.64) 110.27,53.05 147.48,53.05 v1(166.24,34.29)
  Bottom Layer w0.254: ADC0.8 73.66,58.42 104.9,58.42 v1(106.68,56.64) ; v1(185.29,16.76) 172.1,29.95 170.58,29.95 U1.14 v1(166.24,34.29)
MISO1: length 157.3
  Top Layer w0.254: U1.3 182.62,17.65 182.62,9.97 179.93,7.28 ; 179.93,7.28 v1(163.73,7.28) ; 179.93,7.28 R5.1 ; v1(116.84,16.76) 127,16.76 138.18,5.59 146.04,5.59 146.72,6.26 ; 146.72,6.26 147.48,5.5 157.13,5.5 v1(157.89,6.26) ; 146.72,6.26 R1.2
  Inner1 w0.254: v1(163.73,7.28) 162.72,6.26 v1(157.89,6.26)
  Bottom Layer w0.254: ADC1.8 73.66,41.91 91.69,41.91 v1(116.84,16.76)
MOSI0: length 107.2
  Inner2 w0.254: v1(121.16,38.86) v1(126.75,38.86)
  Bottom Layer w0.254: ADC0.10 76.2,55.88 80.26,55.88 81.16,54.98 81.16,54.47 86.11,49.53 110.49,49.53 v1(121.16,38.86) ; U1.13 165.11,37.96 127.64,37.96 v1(126.75,38.86)
MOSI1: length 92.1
  Top Layer w0.254: v1(113.54,31.75) 106.17,39.12 80.01,39.12 78.62,40.5 78.62,41.01 77.72,41.91 76.2,41.91 ADC1.10
  Inner2 w0.254: v1(113.54,31.75) 120.9,31.75 v1(123.7,34.54)
  Bottom Layer w0.254: U1.18 157.35,30.48 127.76,30.48 v1(123.7,34.54)
MUX_EN0: length 44.9
  Top Layer w0.254: MUX0.15 119.65,58.69 118.11,57.15 v1(118.11,56.9)
  Inner1 w0.254: J_MUX.3 97.79,25.4 97.79,27.94 111.26,41.41 111.26,50.05 v1(118.11,56.9)
MUX_EN1: length 74.8
  Top Layer w0.254: v1(147.32,52.32) 152.4,52.32 154.94,54.86 154.94,57.66 154.04,58.56 153.55,58.56 MUX1.15
  Inner2 w0.254: v1(147.32,52.32) 144.53,49.53 139.19,49.53 126.72,37.06 106.91,37.06 J_MUX.4
MUX_OUT0: length 161.2
  Top Layer w0.254: MUX0.1 113.04,64.77 v1(111.51,64.77) ; v1(109.92,56.32) 109.92,55.8 R9.2
  Inner1 w0.254: ADC0.13 81.28,53.34 81.28,41.91 ADC1.15
  Inner2 w0.254: TEST-SCALER0.2 43.31,43.31 50.93,43.31 63.5,55.88 78.74,55.88 ADC0.13 81.28,55.88 82.8,55.88 89.09,62.17 108.9,62.17 ; 108.9,62.17 108.9,57.34 v1(109.92,56.32) ; 108.9,62.17 v1(111.51,64.77)
MUX_OUT1: length 156.2
  Top Layer w0.254: v1(145.03,63.25) 145.03,63.75 145.81,64.54 MUX1.1 ; v1(144.87,53.94) 144.87,53.86 R13.2
  Inner1 w0.254: ADC0.15 81.28,55.88 79.76,55.88 78.86,54.98 78.86,41.79 79.35,41.3 ; 79.35,41.3 79.35,40.28 v1(76.81,37.74) ; 79.35,41.3 ADC1.13
  Inner2 w0.254: 140.3,58.51 v1(145.03,63.25) ; 140.3,58.51 v1(142.33,56.48) ; 140.3,58.51 137.92,56.13 v1(120.65,56.13) ; TEST-SCALER1.2 44.64,11.62 44.64,16.19 48.23,19.78 53.77,19.78 71.73,37.74 v1(76.81,37.74)
  Bottom Layer w0.254: ADC0.15 119.13,54.61 v1(120.65,56.13) ; v1(142.33,56.48) v1(144.87,53.94)
OFFSET_OUT0+: length 127.7
  Top Layer w0.254: 22.55,47.81 22.55,45.02 v1(16.71,39.18) ; 22.55,47.81 R11.1 ; 22.55,47.81 22.87,47.5 64.77,47.5 v1(65.53,48.26)
  Inner1 w0.254: TEST-SCALER0.6 14.92,9.84 14.92,37.38 v1(16.71,39.18)
  Inner2 w0.254: J_AMP0.4 v1(65.53,48.26)
OFFSET_OUT0-: length 134.5
  Top Layer w0.254: R12.1 22.87,52.83 27.94,52.83 v1(28.7,52.07)
  Bottom Layer w0.254: 35.01,45.77 23.33,34.09 23.33,20.79 TEST-SCALER0.4 ; 35.01,45.77 v1(28.7,52.07) ; 35.01,45.77 35.05,45.72 J_AMP0.2
OFFSET_OUT1+: length 151.1
  Top Layer w0.254: v1(53.21,15.11) 53.21,19.43 49.65,22.98 48.38,22.98 43,28.37 29.3,28.37 R14.1 ; J_AMP1.4 v1(115.06,23.62)
  Inner2 w0.254: v1(115.06,23.62) 113.28,21.84 59.95,21.84 v1(53.21,15.11) TEST-SCALER1.6
OFFSET_OUT1-: length 149.9
  Top Layer w0.254: R15.1 22.13,39.4 v1(22.13,40.17)
  Inner1 w0.254: v1(45.5,16.03) 45.5,17.05 37.12,25.43 36.36,25.43 35.46,26.33 35.46,26.84 v1(22.13,40.17)
  Inner2 w0.254: 48.55,12.99 TEST-SCALER1.4 ; 48.55,12.99 57.93,22.37 111.27,22.37 119.35,30.45 121.89,30.45 137.16,45.72 J_AMP1.2 ; 48.55,12.99 v1(45.5,16.03)
ONOFF: length 70.4
  Inner1 w0.254: v1(147.83,11.85) 145.21,9.23 138.09,9.23 133.6,4.74 99.31,4.74 97.67,6.38 97.67,6.89 96.77,7.78 95.25,7.78 GPIO.15
  Bottom Layer w0.254: U1.49 154.78,17.74 153.22,17.74 152.32,16.85 152.32,16.34 v1(147.83,11.85)
PROG: length 68
  Inner1 w0.254: v1(141.99,8.55) 137.67,4.23 98.81,4.23 GPIO.17
  Bottom Layer w0.254: U1.50 152.32,17.83 150.76,17.83 149.86,16.93 149.86,16.42 v1(141.99,8.55)
PWDN0: length 155.4
  Inner2 w0.254: U1.28 192.91,15.24 188.72,15.24 187.85,16.11 187.85,16.87 174.38,30.34 173.62,30.34 172.72,31.24 172.72,32 171.2,33.53 126.24,33.53 v1(121.16,28.45)
  Bottom Layer w0.254: v1(121.16,28.45) 107.95,41.66 107.95,46.23 107.19,46.99 83.57,46.99 76.08,54.47 76.08,54.98 75.18,55.88 66.04,55.88 ADC0.2
PWDN1: length 134.3
  Top Layer w0.254: v1(121.41,22.35) 139.19,22.35 v1(143.76,17.78)
  Inner1 w0.254: U1.31 185.29,17.78 v1(143.76,17.78)
  Bottom Layer w0.254: v1(121.41,22.35) 98.81,44.96 66.55,44.96 ADC1.2
RESET0: length 131.1
  Inner2 w0.254: v1(133.86,45.97) 127.51,52.32 79.76,52.32 ADC0.11
  Bottom Layer w0.254: U1.29 177.81,30.34 176.16,30.34 175.26,31.24 175.26,32 167.58,39.69 158.4,39.69 153.91,44.18 152.64,44.18 151.74,43.28 136.55,43.28 v1(133.86,45.97)
RESET1: length 123.1
  Top Layer w0.254: v1(115.82,16.76) 117.62,18.56 139.97,18.56 v1(140.72,19.3)
  Bottom Layer w0.254: ADC1.11 79.27,38.84 93.74,38.84 v1(115.82,16.76) ; U1.32 182.75,15.24 168.4,15.24 167.64,16 167.64,16.76 161.54,22.86 144.27,22.86 v1(140.72,19.3)
SCLK0: length 113.7
  Top Layer w0.254: v1(107.19,43.43) 92.2,58.42 78.74,58.42 ADC0.12
  Inner2 w0.254: v1(107.19,43.43) 122.17,43.43 v1(125.98,39.62)
  Bottom Layer w0.254: v1(125.98,39.62) 125.98,38.61 127.78,36.81 155.09,36.81 159.89,32 159.89,25.4 U1.38
SCLK1: length 84.6
  Top Layer w0.254: v1(116.08,34.54) 108.71,41.91 78.74,41.91 ADC1.12
  Inner2 w0.254: v1(116.08,34.54) 116.98,35.44 124.6,35.44 v1(125.22,36.07)
  Bottom Layer w0.254: U1.19 151.77,36.07 v1(125.22,36.07)
SELECT0: length 303.4
  Inner1 w0.254: U1.4 195.58,33.15 195.58,66.04 IO5.1 184.91,76.71 169.42,76.71 168.66,77.47 157.23,77.47 156.09,76.34 156.09,75.83 155.19,74.93 151.13,74.93 IO4.1 139.19,76.2 v1(137.85,74.86) 132.08,69.09 TEST-TEENSY.1
  Bottom Layer w0.254: 113.97,75.87 114.87,74.98 137.73,74.98 v1(137.85,74.86) ; 113.97,75.87 IO3.1 ; 113.97,75.87 113.03,74.93 88.54,74.93 87.66,75.81 87.66,76.42 86.77,77.32 79.65,77.32 78.64,76.3 ; 78.64,76.3 IO2.1 ; 78.64,76.3 77.47,77.47 44.45,77.47 IO1.1 41.91,77.47 8.89,77.47 IO0.1
SELECT1: length 305.5
  Top Layer w0.254: 190.63,33.15 190.63,60.71 v1(191.13,61.21) ; 190.63,33.15 190.63,32.77 U1.5 ; 190.63,33.15 153.29,33.15 152.39,32.25 152.39,31.66 v1(145.24,24.51)
  Bottom Layer w0.254: TEST-TEENSY.3 144.98,24.51 v1(145.24,24.51) ; IO0.2 8.89,80.01 41.91,80.01 43.08,78.84 ; 43.08,78.84 IO1.2 ; 43.08,78.84 44.09,79.86 77.62,79.86 78.65,78.83 ; 149.76,78.84 IO4.2 ; 149.76,78.84 148.59,80.01 115.57,80.01 IO3.2 113.12,77.56 88.56,77.56 87.68,78.44 87.68,78.94 86.78,79.84 79.67,79.84 78.65,78.83 ; 149.76,78.84 150.77,79.86 184.3,79.86 IO5.2 186.69,77.47 186.69,74.93 188.49,73.13 188.49,63.86 v1(191.13,61.21) ; 78.65,78.83 IO2.2
SELECT2: length 305.3
  Top Layer w0.254: v1(189.87,63.8) 186.74,66.93 186.74,74.98 ; 186.74,74.98 IO5.3 ; 186.74,74.98 186.69,74.93 153.67,74.93 IO4.3 151.23,77.37 142.9,77.37 139.85,80.42 116.99,80.42 115.72,79.15 115.72,78.13 v1(116.48,77.37) ; v1(48.51,74.93) 80.01,74.93 IO2.3 82.55,74.93 v1(84.07,74.93) ; v1(123.7,12.37) TEST-TEENSY.5
  Inner1 w0.254: 116.74,76.1 IO3.3 ; 116.74,76.1 116.74,77.11 v1(116.48,77.37) ; 116.74,76.1 115.57,74.93 ; v1(84.07,74.93) 115.57,74.93 ; 115.57,74.93 123.65,66.85 123.65,41.45 122.94,40.73 122.94,13.13 v1(123.7,12.37)
  Inner2 w0.254: v1(189.87,63.8) 190.37,63.29 190.37,33.02 U1.6
  Bottom Layer w0.254: v1(48.51,74.93) 46.99,74.93 IO1.3 44.45,74.93 11.43,74.93 IO0.3
SELECT3: length 303.1
  Inner1 w0.254: IO0.4 11.43,80.01 44.45,80.01 45.62,78.84 ; 187.8,78.9 186.18,80.52 154.18,80.52 IO4.4 151.28,79.86 123.41,79.86 ; 187.8,78.9 IO5.4 ; 187.8,78.9 v1(187.04,78.14) ; 123.41,79.86 123.41,74.78 124.3,73.88 124.3,9.22 TEST-TEENSY.7 ; 123.41,79.86 117.75,79.86 116.74,78.84 ; 116.74,78.84 115.57,80.01 82.55,80.01 IO2.4 80.16,79.86 46.63,79.86 45.62,78.84 ; 116.74,78.84 IO3.4 ; 45.62,78.84 IO1.4
  Inner2 w0.254: U1.7 187.8,32.99 187.8,62.9 186.78,63.92 186.78,77.89 v1(187.04,78.14)
SELECT4: length 135.7
  Top Layer w0.254: MUX0.10 115.31,58.69 v1(115.56,58.94) ; v1(144.01,58.69) MUX1.10
  Inner1 w0.254: U1.8 182.76,30.49 178.56,30.49 177.79,31.25 177.79,32.02 169.71,40.1 165.14,40.1 148.08,57.16 145.54,57.16 v1(144.01,58.69)
  Bottom Layer w0.254: 121.91,58.69 v1(144.01,58.69) ; 121.91,58.69 121.91,40.91 122.17,40.65 122.17,9.31 TEST-TEENSY.9 ; 121.91,58.69 115.82,58.69 v1(115.56,58.94)
SELECT5: length 129.8
  Top Layer w0.254: v1(122.68,58.04) 122.93,58.29 125.47,58.29 125.72,58.04 MUX1.11 147.31,58.04 v1(147.57,58.29) ; MUX0.11 v1(115.56,58.04)
  Inner1 w0.254: v1(122.68,58.04) 121.78,57.14 121.78,44.44 119.98,42.64 119.98,9.67 TEST-TEENSY.11
  Inner2 w0.254: v1(115.56,58.04) v1(122.68,58.04)
  Bottom Layer w0.254: v1(147.57,58.29) 165.53,40.33 172.9,40.33 U1.9
SELECT6: length 126.4
  Top Layer w0.254: MUX1.14 153.93,58.04 154.44,57.53 154.44,57.27 153.93,56.77 v1(152.15,56.77) ; v1(120.72,44.32) 120.72,53.97 119.45,55.24 119.45,57.78 119.7,58.04 MUX0.14 121.42,58.04 122.69,59.31 v1(145.04,59.31)
  Inner1 w0.254: v1(145.04,59.31) 149.61,59.31 v1(152.15,56.77) 168.32,40.6 170.09,40.6 U1.10 ; TEST-TEENSY.13 119.45,11.68 119.45,43.05 v1(120.72,44.32)
SELECT7: length 120.4
  Top Layer w0.254: TEST-TEENSY.15 114.3,30.54 121.88,38.12 121.88,55.9 ; 151.52,57.39 151.39,57.39 149.87,55.86 121.93,55.86 121.88,55.9 ; 151.52,57.39 MUX1.13 ; 151.52,57.39 151.52,56.38 v1(153.55,54.35) ; 121.88,55.9 MUX0.13
  Inner2 w0.254: v1(153.55,54.35) 153.8,54.35 U1.11
TADC0+: length 118.1
  Top Layer w0.254: J_AIN-TADC.7 74.17,22.35 88.14,22.35 102.51,7.98 128.08,7.98 TEST-TEENSY.4 131.16,4.9 157.58,4.9 v1(157.83,5.16)
  Inner2 w0.254: U1.35 175.32,17.59 170.78,17.59 169.88,16.7 169.88,15.93 159.1,5.16 v1(157.83,5.16)
TADC0-: length 105.7
  Inner1 w0.254: U1.41 158.36,13.71 139.26,13.71 TEST-TEENSY.2 130.87,7.74 124.09,7.74 123.19,8.64 123.19,9.4 122.43,10.16 v1(121.16,10.16)
  Bottom Layer w0.254: v1(121.16,10.16) 111.68,19.64 71.8,19.64 J_AIN-TADC.3
TADC1+: length 104.8
  Top Layer w0.254: J_AIN-TADC.8 76.2,22.86 98.81,22.86 v1(113.03,8.64)
  Inner1 w0.254: U1.40 159.63,12.44 139.52,12.44 132.33,5.26 125.73,5.26 TEST-TEENSY.8 123.25,7.74 113.93,7.74 v1(113.03,8.64)
TADC1-: length 113.9
  Top Layer w0.254: J_AIN-TADC.4 68.58,25.4 70.36,25.4 71.12,24.64 71.12,23.62 72.92,21.83 87.9,21.83 104.39,5.33 125.81,5.33 TEST-TEENSY.6 129.03,4.49 158.24,4.49 158.62,4.88 U1.42
TLEDS: length 161.1
  Top Layer w0.254: v1(147.84,8.13) 149.61,6.35 R2.1
  Inner1 w0.254: v1(62.03,23.62) 61.27,23.62 23.17,61.72 23.17,63.5 J_LED.1
  Bottom Layer w0.254: v1(147.84,8.13) 144.53,4.83 81.33,4.83 79.81,6.35 79.81,7.11 79.05,7.87 78.28,7.87 77.39,8.77 77.39,9.53 76.49,10.43 75.22,10.43 v1(62.03,23.62)
VOCM: length 9.3
  Top Layer w0.225: AMP0.9 115.09,44.93 J_AMP0.5
VREF: length 146.1
  Top Layer w0.254: 15.88,27.94 U7.5 ; 15.88,27.94 15.75,27.94 15.52,27.71 ; 15.88,27.94 16,27.94 20.83,23.11 v1(20.83,19.81) ; 15.52,27.71 14,29.24 14,33.05 14.63,33.68 U6.3 14.63,49.84 15.53,50.74 15.53,53.74 15.9,54.11 ; 15.52,27.71 14.85,27.04 14.85,26.68 U7.3
  Inner1 w0.254: 83.83,24.12 83.83,26.66 J_VREF.4 ; 83.83,24.12 J_VREF.3 ; 83.83,24.12 84.1,23.85 84.1,19 ; 84.1,19 84.1,18.93 GPIO.16 ; 84.1,19 72.73,7.62 55.88,7.62 TEST-SCALER1.12 53.34,7.62 22.86,7.62 TEST-SCALER0.12 21.59,19.05 v1(20.83,19.81)
VREF0: length 33.1
  Inner1 w0.254: J_VREF.1 76.2,29.21 76.2,53.34 ADC0.9
VREF1: length 21.2
  Top Layer w0.254: ADC1.9 85.09,30.48 85.09,25.4 J_VREF.5
$2N3272: length 80.9
  Inner2 w0.254: OUTPUT_POT0.2 63.5,50.8 J_AMP0.6
$2N3817: length 7.9
  Top Layer w0.225: AMP0.10 114.05,43.43 J_AMP0.3
$2N3823: length 7
  Top Layer w0.225: AMP0.11 112.01,42.93 J_AMP0.1
$2N5156: length 9.3
  Top Layer w0.225: J_AMP1.5 148.11,44.93 AMP1.9
$2N5160: length 101.3
  Inner2 w0.254: OUTPUT_POT1.2 63.75,38.35 115.57,38.35 115.7,38.23 127.13,38.23 J_AMP1.6
$2N5161: length 7.9
  Top Layer w0.225: AMP1.10 147.07,43.43 J_AMP1.3
$2N5162: length 7
  Top Layer w0.225: AMP1.11 145.03,42.93 J_AMP1.1
$3N891: length 15.7
  Top Layer w0.254: D9.1 6.14,58.67 6.14,51.56 6.9,50.8 9.86,50.8 U6.1
$3N1715: length 5.6
  Top Layer w0.254: 13.36,54.11 13.51,54.26 D10.1
$3N3373: length 15.9
  Top Layer w0.254: D11.1 6.14,37.08 6.14,29.97 7.04,29.07 9.43,29.07 U7.1
$3N3374: length 6.2
  Top Layer w0.254: U7.7 13.51,32.15 D12.1
$4N5866: length 29.2
  Top Layer w0.254: R2.2 v1(157.98,8.64)
  Inner2 w0.254: U1.34 177.42,18.03 168.65,18.03 167.63,17.02 167.63,16.26 160.01,8.64 v1(157.98,8.64)

## Copper pours and planes (outline as drawn; the poured copper is in the pictures)
+5V on Top Layer: -8.89,92.71 219.71,92.71 219.71,-5.08 -8.89,-5.08
+5V on Inner2: -6.35,90.17 213.36,90.17 213.36,-5.08 -6.35,-5.08
GND on Bottom Layer: -3.81,88.9 214.63,88.9 214.63,-2.54 -3.81,-2.54
GND on Inner1: -8.89,91.44 214.63,91.44 214.63,-1.27 -8.89,-1.27

## Text on the board
Top Silkscreen Layer: V0.1 | T.F. Weihmann, 2024 | XenControl
